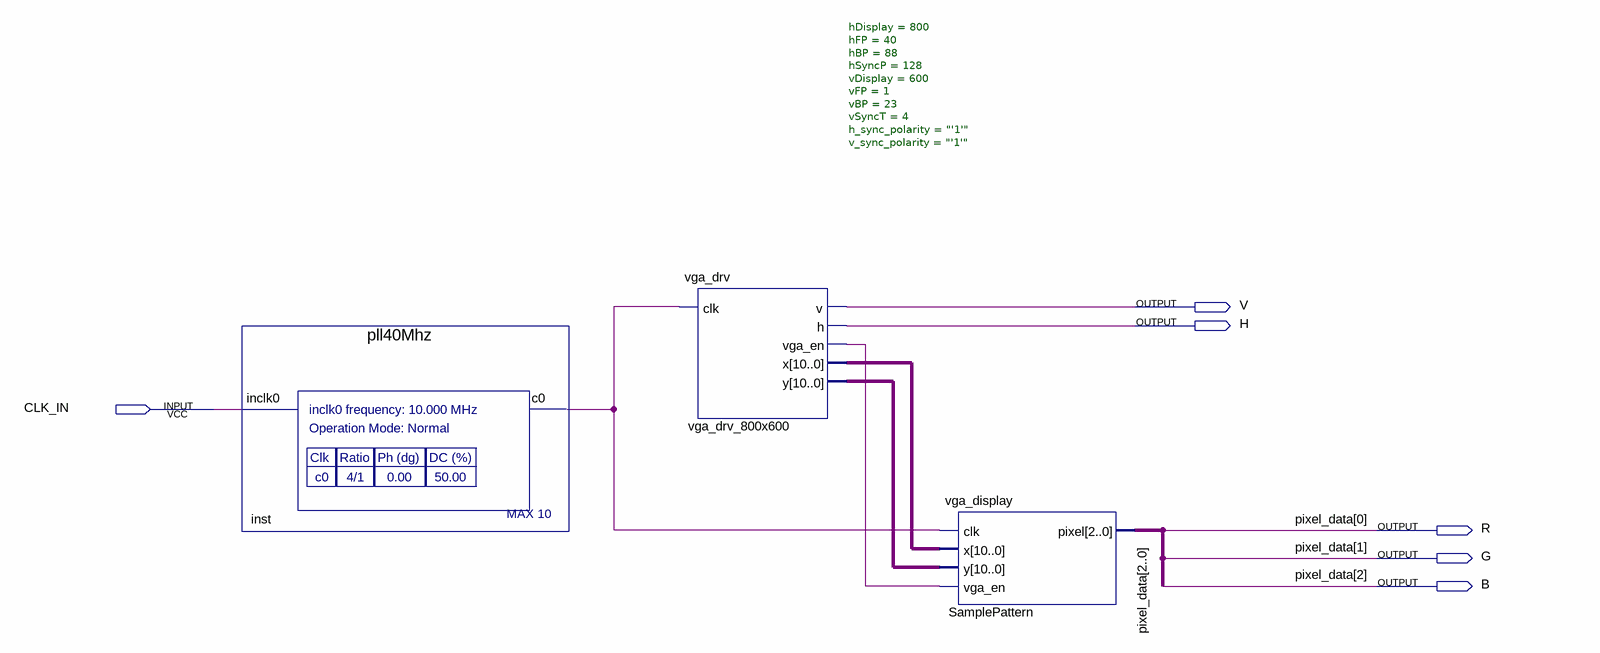
[diagram p0: schematic sheet]
// Quartus schematic VGA.bdf as structural Verilog: 3 symbols, 6 pins
module VGA (
  input  CLK_IN,
  output V,
  output H,
  output R,
  output G,
  output B
);

  wire inst_c0, vga_drv_800x600_vga_en;
  wire [10:0] vga_drv_800x600_x, vga_drv_800x600_y;

  pll40Mhz inst (.inclk0(CLK_IN), .c0(inst_c0));
  vga_drv #(.hDisplay(800), .hFP(40), .hBP(88), .hSyncP(128), .vDisplay(600), .vFP(1), .vBP(23), .vSyncT(4), .h_sync_polarity("'1'"), .v_sync_polarity("'1'")) vga_drv_800x600 (
    .clk(inst_c0), .vga_en(vga_drv_800x600_vga_en), .x(vga_drv_800x600_x), .y(vga_drv_800x600_y), .v(V), .h(H));
  vga_display SamplePattern (
    .clk(inst_c0), .x(vga_drv_800x600_x), .y(vga_drv_800x600_y), .vga_en(vga_drv_800x600_vga_en),
    .pixel({B, G, R}));

  // Other names for the same wires on the sheet: pixel_data[2:0] = {B, G, R}
endmodule
